# Altium schematic sheet Generic_comps.SchDoc
size A4
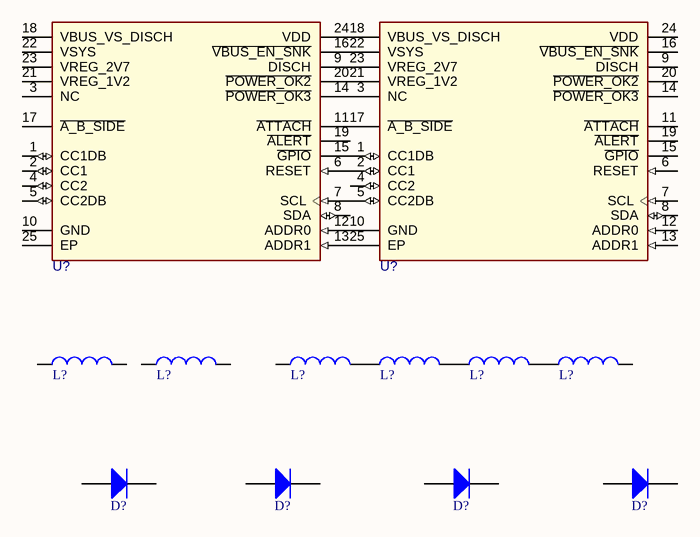
[diagram p0: Generic_comps.SchDoc]

## Parts
(Parts that share a designator on the sheet are numbered #1, #2 ... from top to bottom, then left to right.)
D?#1  Diodes,Diodes,Diodes,Diodes,Diodes,Diodes,Diodes,000  (value not drawn)
D?#2  Diodes,Diodes,Diodes,Diodes,Diodes,Diodes,Diodes,000  (value not drawn)
D?#3  Diodes,Diodes,Diodes,Diodes,Diodes,Diodes,Diodes,000  (value not drawn)
D?#4  Diodes  (value not drawn)
L?#1  Inductors  (value not drawn)
L?#2  Inductors,Inductors,Inductors,Inductors,Inductors,Inductors  (value not drawn)
L?#3  Inductors,Inductors,Inductors,Inductors,Inductors,Inductors  (value not drawn)
L?#4  Inductors,Inductors,Inductors,Inductors,Inductors,Inductors  (value not drawn)
L?#5  Inductors,Inductors,Inductors,Inductors,Inductors,Inductors  (value not drawn)
L?#6  Inductors  (value not drawn)
U?#1  MyTemp,Qwerty 123 Qwerty 123 Qwerty 123 Qwerty 123 Qwerty 123 Qwerty 123 Qwerty 123 Qwerty 123 Qwerty 123 Qwerty 123 Qwerty 123 Qwerty 123 Qwerty 123 Qwerty 123 Qwerty 123 Qwerty 123 Qwerty 123,1,2,3,4,5,6,7  [INDR70-500-1220X900X1220]  (value not drawn)
U?#2  MyTemp,Qwerty 123 Qwerty 123 Qwerty 123 Qwerty 123 Qwerty 123 Qwerty 123 Qwerty 123 Qwerty 123 Qwerty 123 Qwerty 123 Qwerty 123 Qwerty 123 Qwerty 123 Qwerty 123 Qwerty 123 Qwerty 123 Qwerty 123,1,2,3,4,5,6,7  [INDR70-500-1220X900X1220]  (value not drawn)

## Nets
NetL?#3_2: L?#3.2 L?#4.1
NetL?#4_2: L?#4.2 L?#5.1
NetL?#5_2: L?#5.2 L?#6.1
NetU?#1_6: U?#1.6(RESET) U?#2.2(CC1)
NetU?#1_7: U?#1.7(SCL) U?#2.5(CC2DB)
NetU?#1_9: U?#1.9(DISCH) U?#2.23(VREG_2V7)
NetU?#1_11: U?#1.11(~{ATTACH}) U?#2.17(~{A_B_SIDE})
NetU?#1_12: U?#1.12(ADDR0) U?#2.10(GND)
NetU?#1_13: U?#1.13(ADDR1) U?#2.25(EP)
NetU?#1_14: U?#1.14(~{POWER_OK3}) U?#2.3(NC)
NetU?#1_15: U?#1.15(~{GPIO}) U?#2.1(CC1DB)
NetU?#1_16: U?#1.16(~{VBUS_EN_SNK}) U?#2.22(VSYS)
NetU?#1_20: U?#1.20(~{POWER_OK2}) U?#2.21(VREG_1V2)
NetU?#1_24: U?#1.24(VDD) U?#2.18(VBUS_VS_DISCH)

Not connected (* = marked no-connect by the designer): D?#1 1(A) 2(K); D?#2 1(A) 2(K); D?#3 1(A) 2(K); D?#4 1(A) 2(K); L?#1 1 2; L?#2 1 2; L?#3 1; L?#6 2; U?#1 1(CC1DB) 2(CC1) 3(NC) 4(CC2) 5(CC2DB) 8(SDA) 10(GND) 17(~{A_B_SIDE}) 18(VBUS_VS_DISCH) 19(~{ALERT}) 21(VREG_1V2) 22(VSYS) 23(VREG_2V7) 25(EP); U?#2 4(CC2) 6(RESET) 7(SCL) 8(SDA) 9(DISCH) 11(~{ATTACH}) 12(ADDR0) 13(ADDR1) 14(~{POWER_OK3}) 15(~{GPIO}) 16(~{VBUS_EN_SNK}) 19(~{ALERT}) 20(~{POWER_OK2}) 24(VDD)

## Library data of the parts
D?#1-D?#3 = Diodes: Component Type: Diodes
L?#2-L?#5 = Inductors: Component Type: Inductors
U?#1 U?#2 = MyTemp: Power Supply; Parameter: 1; Parameter 1: 2; Parameter 2: 3; Parameter 3: 4; Parameter 4: 5; Parameter 5: 6; Parameter 6: 7; Description: Qwerty 123 Qwerty 123 Qwerty 123 Qwerty 123 Qwerty 123 Qwerty 123 Qwerty 123 Qwerty 123 Qwerty 123 Qwerty 123 Qwerty 123 Qwerty 123 Qwerty 123 Qwerty 123 Qwerty 123 Qwerty 123 Qwerty 123; Component Type: Audio
D?#4 = Diodes: Component Type: Diodes
L?#1 L?#6 = Inductors: Component Type: Inductors